# EAGLE design ocb03 (EAGLE 6.2)
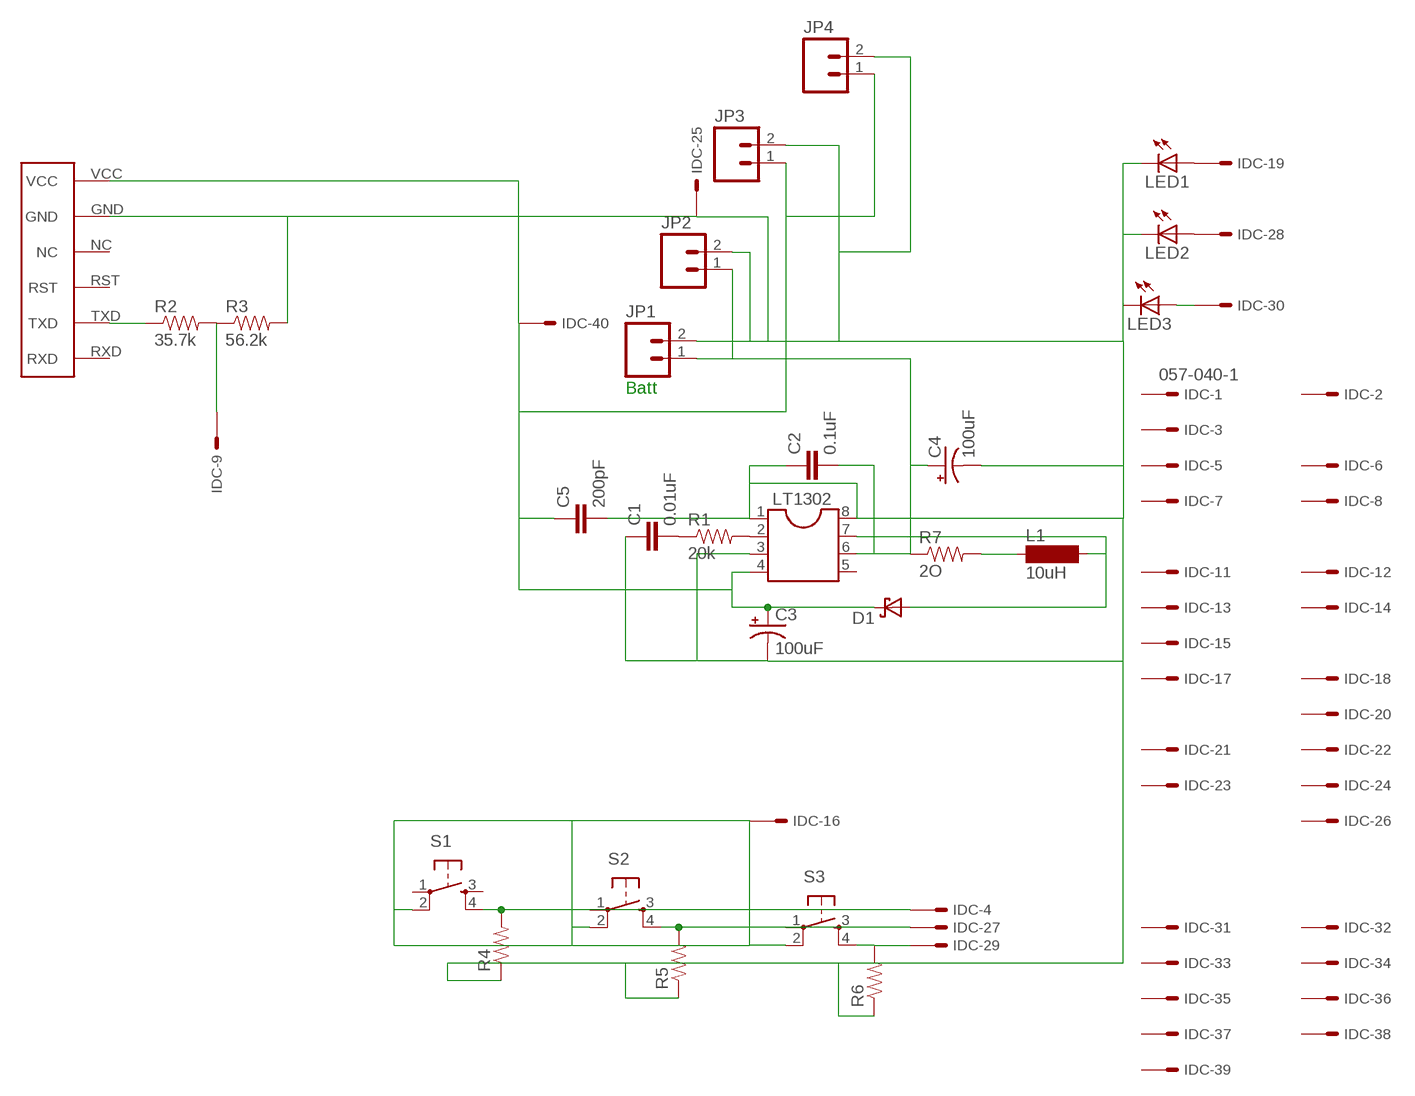
[diagram p0: schematic, sheet 1]

## Parts
C1  0.01uF  CAPPTH  [CAP-PTH-SMALL]
C2  0.1uF  CAPPTH  [CAP-PTH-SMALL]
C3  100uF  CAP_POLPTH1  [CPOL-RADIAL-100UF-25V]
C4  100uF  CAP_POLPTH1  [CPOL-RADIAL-100UF-25V]
C5  200pF  CAPPTH  [CAP-PTH-SMALL]
D1  DS_E2L  [E2LINE]
IDC  057-040-1  [057-040-1]
JP1  M02JST-PTH-2  [JST-2-PTH]
JP2  M02JST-PTH-2  [JST-2-PTH]
JP3  M02JST-PTH-2  [JST-2-PTH]
JP4  M02JST-PTH-2  [JST-2-PTH]
L1  10uH  BS11  [BS11]
LED1  LED5MM  [LED5MM]
LED2  LED5MM  [LED5MM]
LED3  LED5MM  [LED5MM]
LT1302  DIL8  [DIL08]
R1  20k  RESISTORPTH-1/4W  [AXIAL-0.4]
R2  35.7k  RESISTORPTH-1/4W  [AXIAL-0.4]
R3  56.2k  RESISTORPTH-1/4W  [AXIAL-0.4]
R4  RESISTORPTH-1/4W  [AXIAL-0.4]
R5  RESISTORPTH-1/4W  [AXIAL-0.4]
R6  RESISTORPTH-1/4W  [AXIAL-0.4]
R7  2O  RESISTORPTH-1/4W  [AXIAL-0.4]
S1  TAC_SWITCHPTH  [TACTILE-PTH]
S2  TAC_SWITCHPTH  [TACTILE-PTH]
S3  TAC_SWITCHPTH  [TACTILE-PTH]
U$2  SKYLAB_LAB  [SKYLAB_GPS]

## Nets
GND: C1.1 C2.1 C3.2(-) C4.2(-) C5.2 IDC.25 JP1.2 JP2.2 JP3.2 JP4.2 LED1.K(C) LED2.K(C) LED3.K(C) LT1302.1 LT1302.3 LT1302.8 R3.P$2 R4.P$1 R5.P$1 R6.P$1 U$2.GND
N$1: IDC.16 S1.2 S2.2 S3.2
N$2: IDC.29 R6.P$2 S3.4
N$3: LT1302.2 R1.P$2
N$4: C1.2 R1.P$1
N$5: L1.1 R7.P$2
N$6: IDC.19 LED1.A
N$7: C2.2 C4.1(+) JP1.1 JP2.1 LT1302.6 R7.P$1
N$9: D1.2(A) L1.2 LT1302.7
N$10: IDC.28 LED2.A
N$12: IDC.9 R2.P$2 R3.P$1
N$13: IDC.27 R5.P$2 S2.4
N$14: IDC.4 R4.P$2 S1.4
N$15: IDC.30 LED3.A
N$17: C3.1(+) C5.1 D1.1(K) IDC.40 JP3.1 JP4.1 LT1302.4 U$2.VCC
N$18: R2.P$1 U$2.TXD
Unconnected: IDC.1 IDC.2 IDC.3 IDC.5 IDC.6 IDC.7 IDC.8 IDC.10 IDC.11 IDC.12 IDC.13 IDC.14 IDC.15 IDC.17 IDC.18 IDC.20 IDC.21 IDC.22 IDC.23 IDC.24 IDC.26 IDC.31 IDC.32 IDC.33 IDC.34 IDC.35 IDC.36 IDC.37 IDC.38 IDC.39 LT1302.5 S1.1 S1.3 S2.1 S2.3 S3.1 S3.3 U$2.NC U$2.RST U$2.RXD

## Notes on the sheet
- Batt

## Library data of the parts
C1 C2 C5 = SparkFun:CAP: Capacitor Standard 0603 ceramic capacitor, and 0.1" leaded capacitor.
C3 C4 = SparkFun:CAP_POL: Capacitor Polarized These are standard SMD and PTH capacitors. Normally 10uF, 47uF, and 100uF in electrolytic and tantalum varieties. Always verify the external diameter of the through hole cap, it varies with capacity, voltage, and manufacturer. The EIA devices should be standard.
D1 = zetex:DS_E2L: SHOTTKY DIODE; OC_FARNELL: unknown; OC_NEWARK: unknown
IDC = con-panduit:057-040-: CONNECTOR 40-pin series 057 contact pc board low profile headers; OC_FARNELL: unknown; OC_NEWARK: unknown
JP1-JP4 = SparkFun:M02: Header 2 Standard 2-pin 0.1" header. Use with straight break away headers (SKU : PRT-00116), right angle break away headers (PRT-00553), swiss pins (PRT-00743), machine pins (PRT-00117), and female headers (PRT-00115). Molex polarized connector foot print use with SKU : PRT-08233 with associated crimp pins and housings.
L1 = inductor-neosid:BS: INDUCTOR nominal inductance, magnetically screened; OC_FARNELL: unknown; OC_NEWARK: unknown
LED1-LED3 = led:LED: LED OSRAM: - CHIPLED LG R971, LG N971, LY N971, LG Q971, LY Q971, LO R971, LY R971 LH N974, LH R974 LS Q976, LO Q976, LY Q976 LO Q996 - Hyper CHIPLED LW Q18S LB Q993, LB Q99A, LB R99A - SideLED LS A670, LO A670, LY A670, LG A670, LP A670 LB A673, LV A673, LT A673, LW A673 LH A674 LY A675 LS A676, LA A676, LO A676, LY A676, LW A676 LS A679, LY A679, LG A679 - Hyper Micro SIDELED® LS Y876, LA Y876, LO Y876, LY Y876 LT Y87S - SmartLED LW L88C, LW L88S LB L89C, LB L89S, LG L890 LS L89K, LO L89K, LY L89K LS L896, LA L896, LO L896, LY L896 - TOPLED LS T670, LO T670, LY T670, LG T670, LP T670 LSG T670, LSP T670, LSY T670, LOP T670, LYG T670 LG T671, LOG T671, LSG T671 LB T673, LV T673, LT T673, LW T673 LH T674 LS T676, LA T676, LO T676, LY T676, LB T676, LH T676, LSB T676, LW T676 LB T67C, LV T67C, LT T67C, LS T67K, LO T67K, LY T67K, LW E67C LS E67B, LA E67B, LO E67B, LY E67B, LB E67C, LV E67C, LT E67C LW T67C LS T679, LY T679, LG T679 LS T770, LO T770, LY T770, LG T770, LP T770 LB T773, LV T773, LT T773, LW T773 LH T774 LS E675, LA E675, LY E675, LS T675 LS T776, LA T776, LO T776, LY T776, LB T776 LHGB T686 LT T68C, LB T68C - Hyper Mini TOPLED® LB M676 - Mini TOPLED Santana® LG M470 LS M47K, LO M47K, LY M47K Source: http://www.osram.convergy.de LUXEON: - LUMILED® LXK2-PW12-R00, LXK2-PW12-S00, LXK2-PW14-U00, LXK2-PW14-V00 LXK2-PM12-R00, LXK2-PM12-S00, LXK2-PM14-U00 LXK2-PE12-Q00, LXK2-PE12-R00, LXK2-PE12-S00, LXK2-PE14-T00, LXK2-PE14-U00 LXK2-PB12-K00, LXK2-PB12-L00, LXK2-PB12-M00, LXK2-PB14-N00, LXK2-PB14-P00, LXK2-PB14-Q00 LXK2-PR12-L00, LXK2-PR12-M00, LXK2-PR14-Q00, LXK2-PR14-R00 LXK2-PD12-Q00, LXK2-PD12-R00, LXK2-PD12-S00 LXK2-PH12-R00, LXK2-PH12-S00 LXK2-PL12-P00, LXK2-PL12-Q00, LXK2-PL12-R00 Source: www.luxeon.com KINGBRIGHT: KA-3528ASYC Source: www.kingbright.com
LT1302 = ic-package:DIL8: Dual In Line / Socket
R1-R7 = SparkFun:RESISTOR: Resistor Basic schematic elements and footprints for 0603, 1206, and PTH resistors.
S1-S3 = SparkFun:TAC_SWITCH: Momentary Switch Button commonly used for reset or general input. Spark Fun Electronics SKU : COM-00097
U$2 = custom:SKYLAB_LAB

## Board
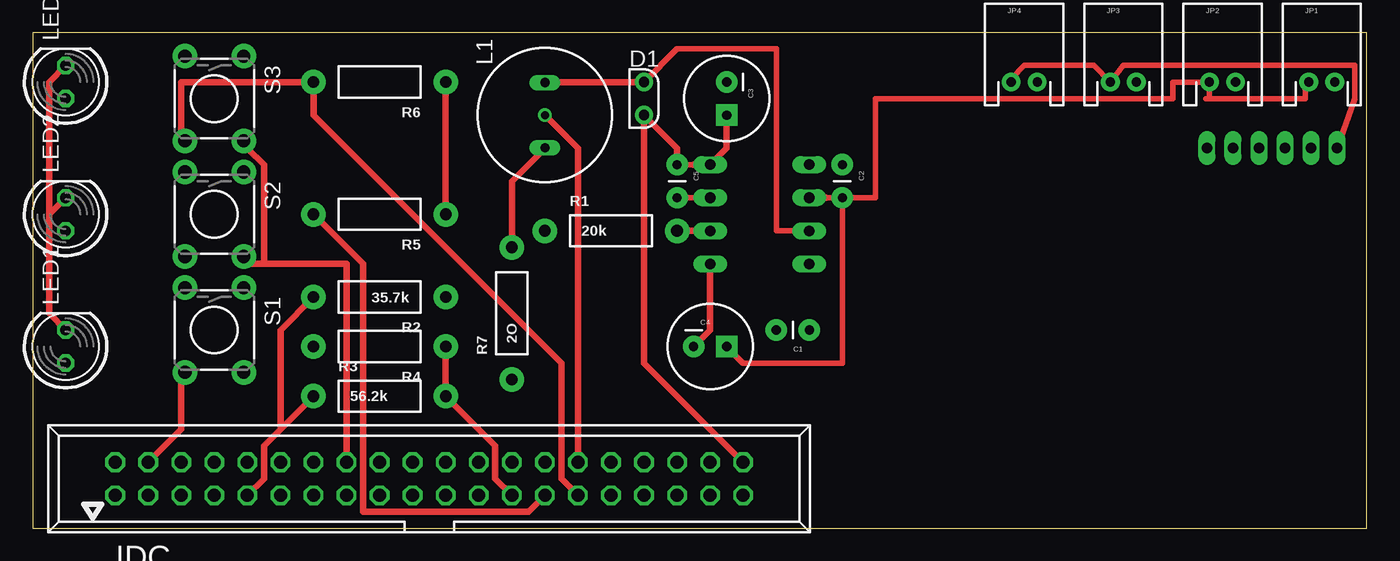
[diagram p1: board, top side]
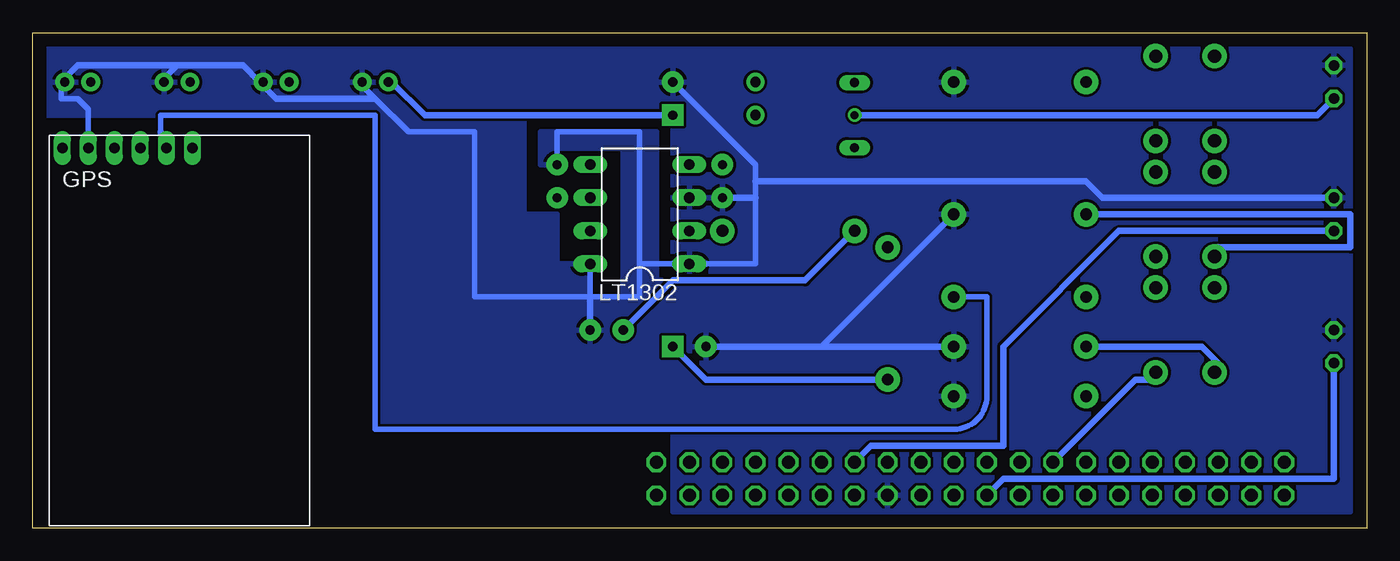
[diagram p2: board, bottom side, seen from below]

Size 102.54 x 38.09 mm. Coordinates in mm from the lower left corner, seen from the top.
Outline: 0,0 102.54,0 102.54,38.09 0,38.09 0,0
Copper layers (1*16): Top 0.035mm / dielectric 100mil / Bottom 0.035mm
Design rules: minimum track width 20mil, minimum drill 24mil, track to track 8mil, track to pad 8mil, pad to pad 8mil, via to via 8mil, smd to smd 8mil, copper to edge 40mil, drill to drill 8mil, minimum pad ring 10mil, minimum via ring 8mil, stop-mask expansion 4mil, vias tented up to drill 0mil, thermal gap 10mil

### Footprints (pad centres in the part's own frame; a part is rotated, then mirrored left to right if it is on the bottom)
CAP-PTH-SMALL = drill 0.7 pad 1.651: 1 0,0; 2 2.54,0
CPOL-RADIAL-100UF-25V = drill 0.7 pad 1.651 square: 1 1.27,0 | drill 0.7 pad 1.651: 2 -1.27,0
E2LINE = drill 0.8 pad 1.397: 1 0,-1.27; 2 0,1.27
057-040-1 = drill 1 octagon: 1 -24.13,-1.27; 2 -24.13,1.27; 3 -21.59,-1.27; 4 -21.59,1.27; 5 -19.05,-1.27; 6 -19.05,1.27; 7 -16.51,-1.27; 8 -16.51,1.27; 9 -13.97,-1.27; 10 -13.97,1.27; 11 -11.43,-1.27; 12 -11.43,1.27; 13 -8.89,-1.27; 14 -8.89,1.27; 15 -6.35,-1.27; 16 -6.35,1.27; 17 -3.81,-1.27; 18 -3.81,1.27; 19 -1.27,-1.27; 20 -1.27,1.27; 21 1.27,-1.27; 22 1.27,1.27; 23 3.81,-1.27; 24 3.81,1.27; 25 6.35,-1.27; 26 6.35,1.27; 27 8.89,-1.27; 28 8.89,1.27; 29 11.43,-1.27; 30 11.43,1.27; 31 13.97,-1.27; 32 13.97,1.27; 33 16.51,-1.27; 34 16.51,1.27; 35 19.05,-1.27; 36 19.05,1.27; 37 21.59,-1.27; 38 21.59,1.27; 39 24.13,-1.27; 40 24.13,1.27
JST-2-PTH = drill 0.7 pad 1.448: 1 -1,0; 2 1,0
BS11 = drill 0.7 long: 1 -2.5,0; 2 2.5,0
LED5MM = drill 0.813 octagon: A -1.27,0; K 1.27,0
DIL08 = drill 0.813 long: 1 -3.81,-3.81; 2 -1.27,-3.81; 3 1.27,-3.81; 4 3.81,-3.81; 5 3.81,3.81; 6 1.27,3.81; 7 -1.27,3.81; 8 -3.81,3.81
AXIAL-0.4 = drill 0.9 pad 1.88: P$1 -5.08,0; P$2 5.08,0
TACTILE-PTH = drill 1.016 pad 1.88: 1 -3.251,2.261; 2 3.251,2.261; 3 -3.251,-2.261; 4 3.251,-2.261
SKYLAB_GPS = drill 0.8 long: GND -3,0; NC -1,0; RST 1,0; RXD 5,0; TXD 3,0; VCC -5,0

### Placement (x,y rotation side)
C1  59.69,15.24 180 top
C2  62.23,27.94 270 top
C3  53.34,33.02 270 top
C4  52.07,13.97 0 top
C5  49.53,27.94 270 top
D1  46.99,33.02 0 top
IDC  30.48,3.81 0 top
JP1  99.06,34.29 0 top
JP2  91.44,34.29 0 top
JP3  83.82,34.29 0 top
JP4  76.2,34.29 0 top
L1  39.37,31.75 90 top
LED1  2.54,13.97 90 top
LED2  2.54,24.13 90 top
LED3  2.54,34.29 90 top
LT1302  55.88,24.13 90 bottom
R1  44.45,22.86 0 top
R2  26.67,17.78 180 top
R3  26.67,10.16 0 top
R4  26.67,13.97 180 top
R5  26.67,24.13 180 top
R6  26.67,34.29 180 top
R7  36.83,16.51 90 top
S1  13.97,15.24 270 top
S2  13.97,24.13 270 top
S3  13.97,33.02 270 top
U$2  95.25,29.21 0 bottom

### Tracks (layer width: path | path; a pad name or v marks a point on that pad's centre or on a via)
GND
  Top 0.406: C5.2 LT1302.3
  Top 0.508: LED1.K 1.27,16.51 1.27,24.13 | LED2.K 1.27,24.13 | LED3.K 1.27,34.29 1.27,24.13 | R4.P$1 R3.P$2 35.56,6.35 35.56,3.81 IDC.25 | R6.P$1 R5.P$1 | C4.2 52.07,15.24 LT1302.1
  Bottom 0.406: U$2.GND 98.25,32.21 99.06,33.02 100.33,33.02 100.33,34.02 JP1.2 | C2.1 62.23,30.48 55.88,30.48 55.88,20.32 | 55.88,20.32 53.34,20.32 | LT1302.8 59.69,17.78 | 59.69,17.78 55.88,17.78 55.88,20.32 | JP4.2 77.2,34.02 76.2,33.02 73.66,30.48 68.58,30.48 68.58,17.78 59.69,17.78 | C3.2 46.99,27.94 46.99,26.67 46.99,25.4 46.99,20.32 50.8,20.32
  Bottom 0.508: 50.8,20.32 LT1302.1 53.34,20.32 | C1.1 59.69,17.78 | 85.09,34.29 83.82,33.02 76.2,33.02 | 91.44,35.56 92.71,34.29 JP2.2 | 91.44,35.56 86.36,35.56 85.09,34.29 | 85.09,34.29 JP3.2 | 46.99,25.4 C5.2 | 91.44,35.56 99.06,35.56 100.33,34.29 JP1.2 | C4.2 41.91,13.97 | 41.91,13.97 R4.P$1 | 41.91,13.97 R5.P$1 | LED2.K 20.32,25.4 21.59,26.67 46.99,26.67
  pour Bottom: 62.23,27.94 63.5,27.94 63.5,30.48 54.61,30.48 54.61,19.05 53.34,19.05 53.34,17.78 57.15,17.78 57.15,29.21 62.23,29.21
  pour Bottom: 101.6,36.83 1.27,36.83 1.27,31.75 101.6,31.75
  pour Bottom: 80.01,31.75 80.01,1.27 64.77,1.27 64.77,2.54 64.77,31.75
  pour Bottom: 64.77,17.78 53.34,17.78 53.34,1.27 64.77,1.27
  pour Bottom: 53.34,31.75 53.34,1.27 1.27,1.27 1.27,31.75
  pour Bottom: 59.69,17.78 59.69,20.32 62.23,20.32 62.23,24.13 64.77,24.13 64.77,17.78
N$1
  Top 0.508: 17.78,20.32 24.13,20.32 IDC.16 | 17.78,20.32 16.51,20.32 S2.2 | 17.78,20.32 17.78,27.94 16.51,29.21 S3.2
  Bottom 0.508: IDC.16 17.78,11.43 16.51,11.43 S1.2
N$2
  Top 0.508: S3.4 11.43,30.48 11.43,34.29 R6.P$2 21.59,31.75 40.64,12.7 40.64,3.81 IDC.29
N$3
  Top 0.508: R1.P$2 LT1302.2
N$4
  Bottom 0.508: C1.2 53.34,19.05 43.18,19.05 R1.P$1
N$5
  Top 0.508: R7.P$2 36.83,26.67 39.37,29.21 L1.1
N$6
  Bottom 0.508: LED1.A 2.54,3.81 27.94,3.81 IDC.19
N$7
  Top 0.406: 90.17,34.29 87.63,34.29 87.63,33.02 64.77,33.02 64.77,25.4 C2.2 | C4.1 54.61,12.7 62.23,12.7 C2.2 | C2.2 60.96,25.4 | JP1.1 97.79,34.29 97.79,33.02 90.44,33.02 | 90.17,33.02 90.44,33.02 | 90.44,33.02 JP2.1
  Top 0.508: 60.96,25.4 LT1302.6 | 90.17,34.29 JP2.1
  Bottom 0.508: C4.1 50.8,11.43 R7.P$1
N$9
  Top 0.406: LT1302.7 57.15,22.86 57.15,36.83 49.53,36.83 D1.2
  Top 0.508: D1.2 39.37,34.29 L1.2
N$10
  Bottom 0.508: LED2.A 19.05,22.86 27.94,13.97 27.94,6.35 38.1,6.35 IDC.28
N$12
  Top 0.508: IDC.9 17.78,3.81 17.78,6.35 19.05,7.62 | R3.P$1 19.05,7.62 | R2.P$2 19.05,15.24 19.05,7.62
N$13
  Top 0.508: IDC.27 38.1,1.27 25.4,1.27 25.4,20.32 R5.P$2
  Bottom 0.508: R5.P$2 1.27,24.13 1.27,21.59 11.43,21.59 S2.4
N$14
  Top 0.508: IDC.4 11.43,7.62 11.43,11.43 S1.4
  Bottom 0.508: R4.P$2 12.7,13.97 11.43,12.7 S1.4
N$15  (via drill 0.61)
  Top 0.508: v39.37,31.75 41.91,29.21 IDC.30
  Bottom 0.508: LED3.A 3.81,31.75 v39.37,31.75
N$17
  Top 0.406: 74.93,34.29 JP4.1 75.2,34.56 76.2,35.56 81.55,35.56 JP3.1 83.82,35.56 101.6,35.56 101.6,33.02 U$2.VCC | C5.1 50.8,27.94
  Top 0.508: C3.1 53.34,29.21 LT1302.4 50.8,27.94 | C5.1 49.53,29.21 D1.1 46.99,12.7 IDC.40
  Bottom 0.508: C3.1 72.39,31.75 74.93,34.29 JP4.1
N$18
  Bottom 0.406: 92.71,30.48 92.71,31.75 76.2,31.75 76.2,7.62 31.75,7.62 arc-90 29.21,10.16 29.21,17.78 R2.P$1
  Bottom 0.508: 92.71,30.48 U$2.TXD